# EAGLE design transceiver-AX5043 (EAGLE 9.5.1)
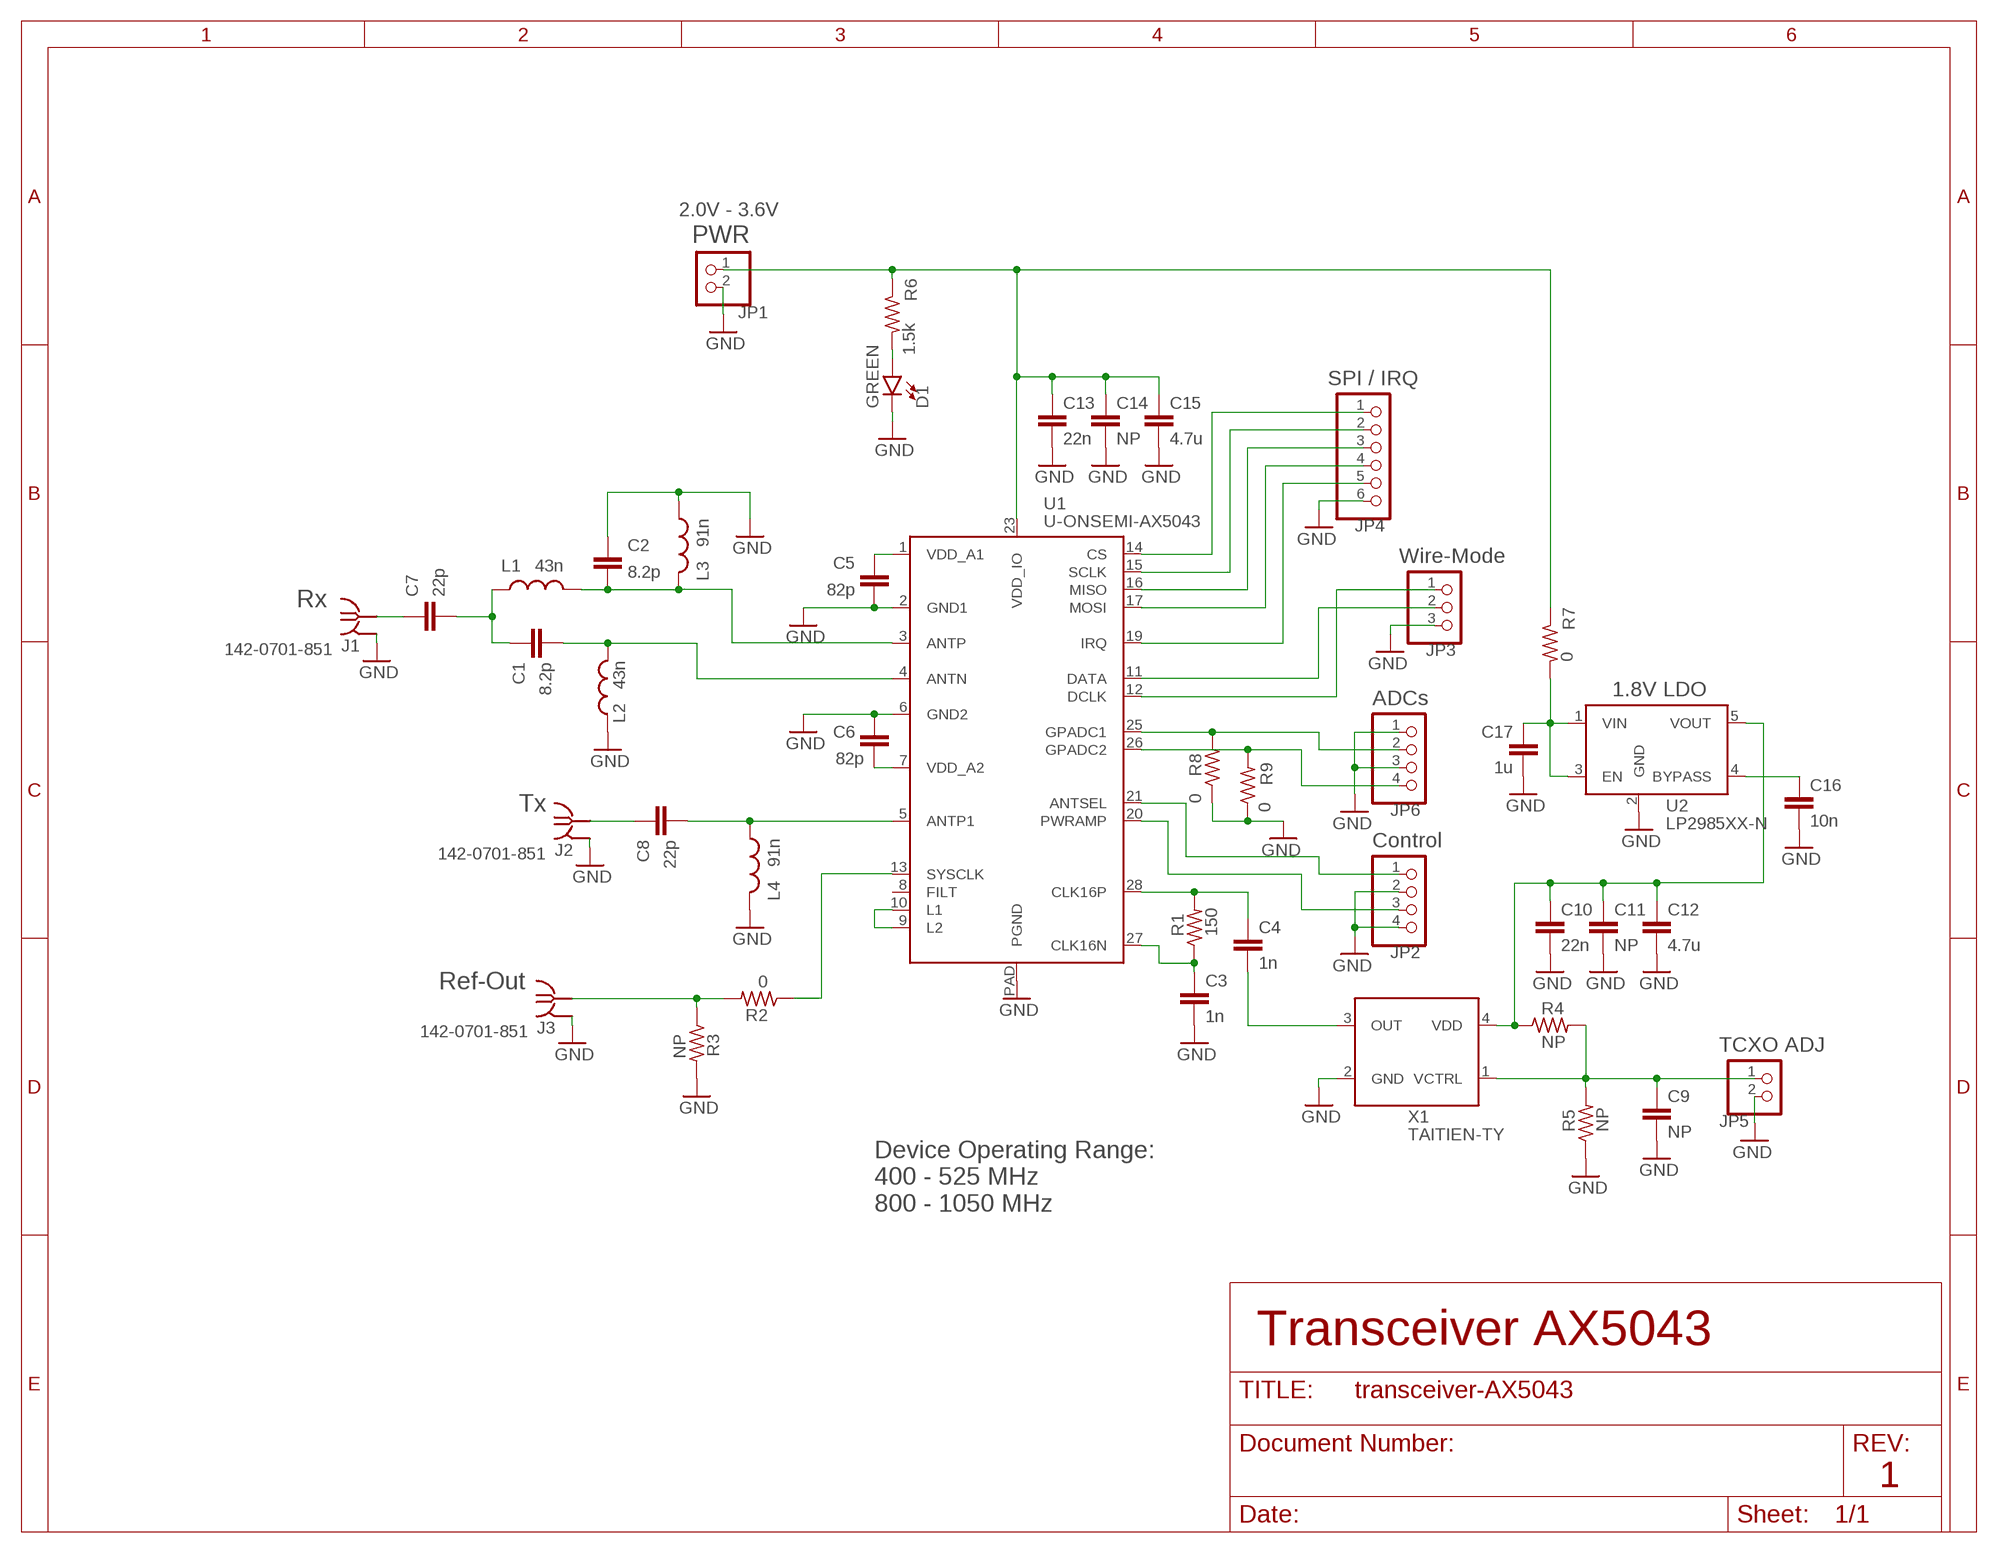
[diagram p0: schematic, sheet 1]

## Parts
C1  8.2p  C-EU0402-C-NOSILK  [.0402-C-NOSILK]
C2  8.2p  C-EU0402-C-NOSILK  [.0402-C-NOSILK]
C3  1n  C-EU0402-C-NOSILK  [.0402-C-NOSILK]
C4  1n  C-EU0402-C-NOSILK  [.0402-C-NOSILK]
C5  82p  C-EU0402-C-NOSILK  [.0402-C-NOSILK]
C6  82p  C-EU0402-C-NOSILK  [.0402-C-NOSILK]
C7  22p  C-EU0402-C-NOSILK  [.0402-C-NOSILK]
C8  22p  C-EU0402-C-NOSILK  [.0402-C-NOSILK]
C9  NP  C-EU0603-C-NOSILK  [.0603-C-NOSILK]
C10  22n  C-EU0603-C-NOSILK  [.0603-C-NOSILK]
C11  NP  C-EU0603-C-NOSILK  [.0603-C-NOSILK]
C12  4.7u  C-EU0603-C-NOSILK  [.0603-C-NOSILK]
C13  22n  C-EU0603-C-NOSILK  [.0603-C-NOSILK]
C14  NP  C-EU0603-C-NOSILK  [.0603-C-NOSILK]
C15  4.7u  C-EU0603-C-NOSILK  [.0603-C-NOSILK]
C16  10n  C-EU0603-C-NOSILK  [.0603-C-NOSILK]
C17  1u  C-EU0603-C-NOSILK  [.0603-C-NOSILK]
D1  GREEN  LED-GREEN0603  [LED-0603]
J1  142-0701-851  [142-0701-851]
J2  142-0701-851  [142-0701-851]
J3  142-0701-851  [142-0701-851]
JP1  PINHD-1X2  [1X02]
JP2  PINHD-1X4  [1X04]
JP3  PINHD-1X3  [1X03]
JP4  PINHD-1X6  [1X06]
JP5  PINHD-1X2  [1X02]
JP6  PINHD-1X4  [1X04]
L1  43n  L-US0402-C-NOSILK  [.0402-C-NOSILK]
L2  43n  L-US0402-C-NOSILK  [.0402-C-NOSILK]
L3  91n  L-US0603-C-NOSILK  [.0603-C-NOSILK]
L4  91n  L-US0603-C-NOSILK  [.0603-C-NOSILK]
R1  150  R-US_0402-C-NOSILK  [.0402-C-NOSILK]
R2  0  R-US_0402-C-NOSILK  [.0402-C-NOSILK]
R3  NP  R-US_0402-C-NOSILK  [.0402-C-NOSILK]
R4  NP  R-US_0603-B-NOSILK  [.0603-B-NOSILK]
R5  NP  R-US_0603-B-NOSILK  [.0603-B-NOSILK]
R6  1.5k  R-US_0603-B-NOSILK  [.0603-B-NOSILK]
R7  0  R-US_0603-C-NOSILK  [.0603-C-NOSILK]
R8  0  R-US_0402-C-NOSILK  [.0402-C-NOSILK]
R9  0  R-US_0402-C-NOSILK  [.0402-C-NOSILK]
U1  U-ONSEMI-AX5043  [QFN28-5X5-WITH-CENTER-PAD]
U2  LP2985XX-N  [SOT-23]
X1  TAITIEN-TY  [2.5X2.0]

## Nets
1V8: C10.1 C11.1 C12.1 R4.1 U2.5(VOUT) X1.4(VDD)
2V7: C13.1 C14.1 C15.1 JP1.1 R6.1 R7.1 U1.23(VDD_IO)
ADC1: JP6.2 R8.2 U1.25(GPADC1)
ADC2: JP6.4 R9.2 U1.26(GPADC2)
ANTN: C1.2 L2.2 U1.4(ANTN)
ANTP: C2.2 L1.2 L3.1 U1.3(ANTP)
ANTP1: C8.2 L4.2 U1.5(ANTP1)
ANTSEL: JP2.1 U1.21(ANTSEL)
CLKN: C3.1 R1.1 U1.27(CLK16N)
CLKP: C4.1 R1.2 U1.28(CLK16P)
CS: JP4.1 U1.14(CS)
DATA: JP3.2 U1.11(DATA)
DCLK: JP3.1 U1.12(DCLK)
GND: C2.1 C3.2 C5.2 C6.1 C9.2 C10.2 C11.2 C12.2 C13.2 C14.2 C15.2 C16.2 C17.2 D1.C J1.GND1(GND) J1.GND2(GND) J1.GND3(GND) J1.GND4(GND) J2.GND1(GND) J2.GND2(GND) J2.GND3(GND) J2.GND4(GND) J3.GND1(GND) J3.GND2(GND) J3.GND3(GND) J3.GND4(GND) JP1.2 JP2.2 JP2.4 JP3.3 JP4.6 JP5.2 JP6.1 JP6.3 L2.1 L3.2 L4.1 R3.2 R5.1 R8.1 R9.1 U1.2(GND1) U1.6(GND2) U1.PAD(PGND) U2.2(GND) X1.2(GND)
IRQ: JP4.5 U1.19(IRQ)
MISO: JP4.3 U1.16(MISO)
MOSI: JP4.4 U1.17(MOSI)
N$1: C5.1 U1.1(VDD_A1)
N$2: C17.1 R7.2 U2.1(VIN) U2.3(EN)
N$3: U1.9(L2) U1.10(L1)
N$6 [RF2]: C4.2 X1.3(OUT)
N$20 [RF2]: C1.1 C7.2 L1.1
N$23: C9.1 JP5.1 R4.2 R5.2 X1.1(VCTRL)
N$26: D1.A R6.2
N$27: C16.1 U2.4(BYPASS)
N$30: C6.2 U1.7(VDD_A2)
PWRAMP: JP2.3 U1.20(PWRAMP)
REF-OUT [RF1]: J3.RF1(RF) R2.2 R3.1
RX [RF1]: C7.1 J1.RF1(RF)
SCLK: JP4.2 U1.15(SCLK)
SYSCLK: R2.1 U1.13(SYSCLK)
TX [RF1]: C8.1 J2.RF1(RF)
Unconnected: U1.8(FILT)

## Notes on the sheet
- 2.0V - 3.6V
- PWR
- SPI / IRQ
- Wire-Mode
- Rx
- 1.8V LDO
- ADCs
- Tx
- Control
- Ref-Out
- TCXO ADJ
- Device Operating Range:
  400 - 525 MHz
  800 - 1050 MHz
- Transceiver AX5043
- 1

## Library data of the parts
C1-C17 = oresat-rcl:C-EU: CAPACITOR, European symbol
D1 = SparkFun-LED:LED-GREEN: Green SMD LED Used in manufacturing of various products at SparkFun Packages: 0603 - SMD 0603 package [Product Link] <http://www.futureelectronics.com/en/technologies/semiconductors/optoelectronics/leds/Pages/9894312-LTST-C190GKT.aspx?CrossPart=HSMG-C190&IM=0> LilyPad 1206 - SMD1206 LilyPad package [Product Link] <http://www.futureelectronics.com/en/Technologies/Product.aspx?ProductID=IN150NGHARVATEKCORPORATION2049943&IM=0> 1206 - SMD1206 package [Product Link] <http://www.futureelectronics.com/en/technologies/semiconductors/optoelectronics/leds/Pages/8315665-LTST-C150KGKT.aspx?IM=0> 1206 Bottom Mount -SMD 1206 Bottom Mount [Product Link] <http://www.digikey.com/product-detail/en/lite-on-inc/LTST-C230KGKT/160-1456-1-ND/386854> SparkFun Products: Pro Mini 328 -5V <https://www.sparkfun.com/products/821> RedBoard <https://www.sparkfun.com/products/12757> MP3 Trigger <https://www.sparkfun.com/products/13720> Makey Makey <https://www.sparkfun.com/products/11076>
J1-J3 = J-Cinch-142-0701-851-SMA-end-launch:142-0701-851: SMA Jack 50Ω - End Launch Source: Datasheet <https://belfuse.com/resources/productinformations/cinchconnectivitysolutions/johnson/pi-ccs-john-142-0701-851.pdf>
JP1 JP5 = pinhead:PINHD-1X2: PIN HEADER
JP2 JP6 = pinhead:PINHD-1X4: PIN HEADER
JP3 = pinhead:PINHD-1X3: PIN HEADER
JP4 = pinhead:PINHD-1X6: PIN HEADER
L1-L4 = oresat-rcl:L-US: INDUCTOR, American symbol
R1-R9 = oresat-rcl:R-US_: RESISTOR, American symbol
U1 = U-ON-Semi-AX5043-radio:U-ONSEMI-AX5043
U2 = U-TI-LP2985XX-N-linear-reg:LP2985XX-N: TI 150mA Low Noise LDO Regulators LP2985-N (various fixed >2.0V) Source: Datasheet <http://www.ti.com/product/LP2985-N?qgpn=lp2985-n> LP2985LV-N (1.5, 1.8, 2.0V fixed) Source: Datasheet <http://www.ti.com/product/LP2985LV-N?qgpn=lp2985lv-n>
X1 = X-Taitien-TY-TCXO:TAITIEN-TY: Clipped Sine Wave TCXO Stability: 1.0ppm (-40 to +85 ℃) Source: Datasheet <https://www.taitien.com/wp-content/uploads/2015/12/XO-0081_TY.pdf>

## Net classes
1 RF1: clearance 0.8 mm
2 RF2: clearance 0.4 mm

## Board
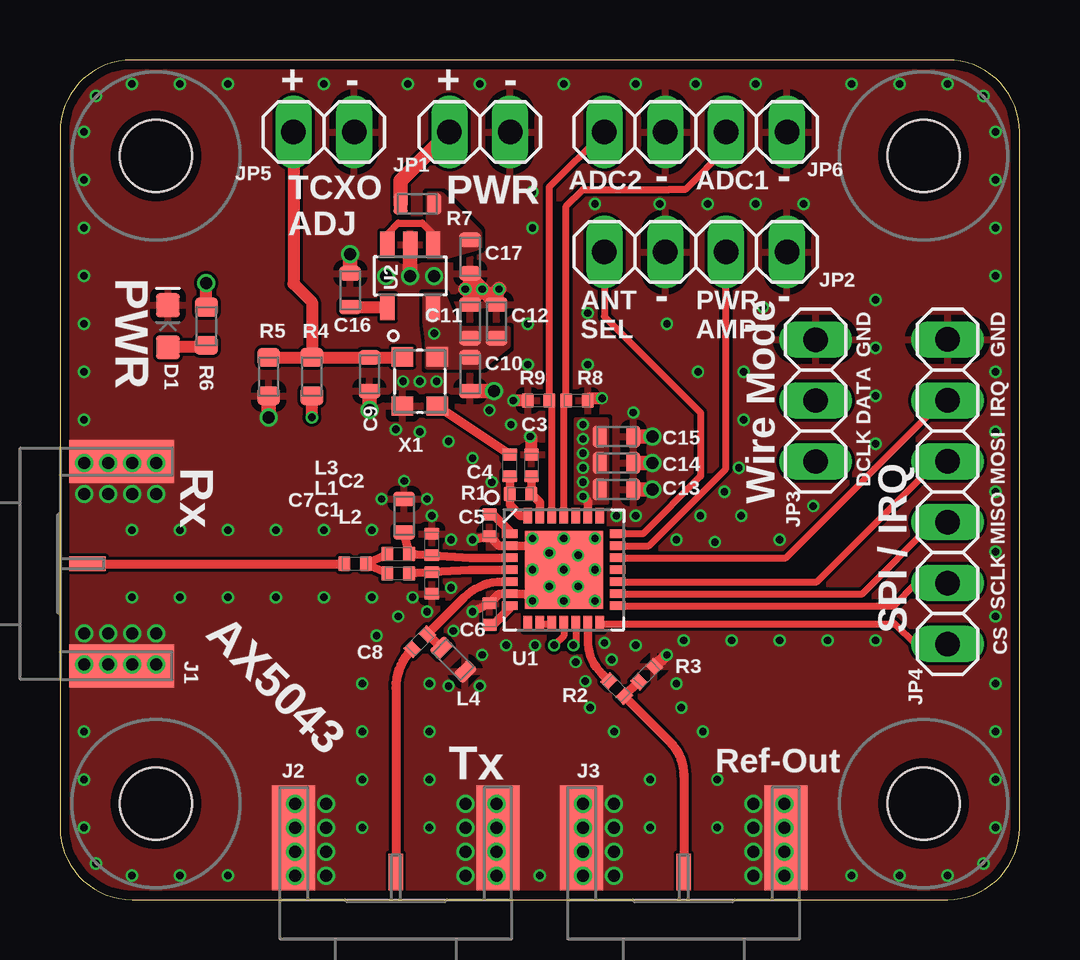
[diagram p1: board, top side]
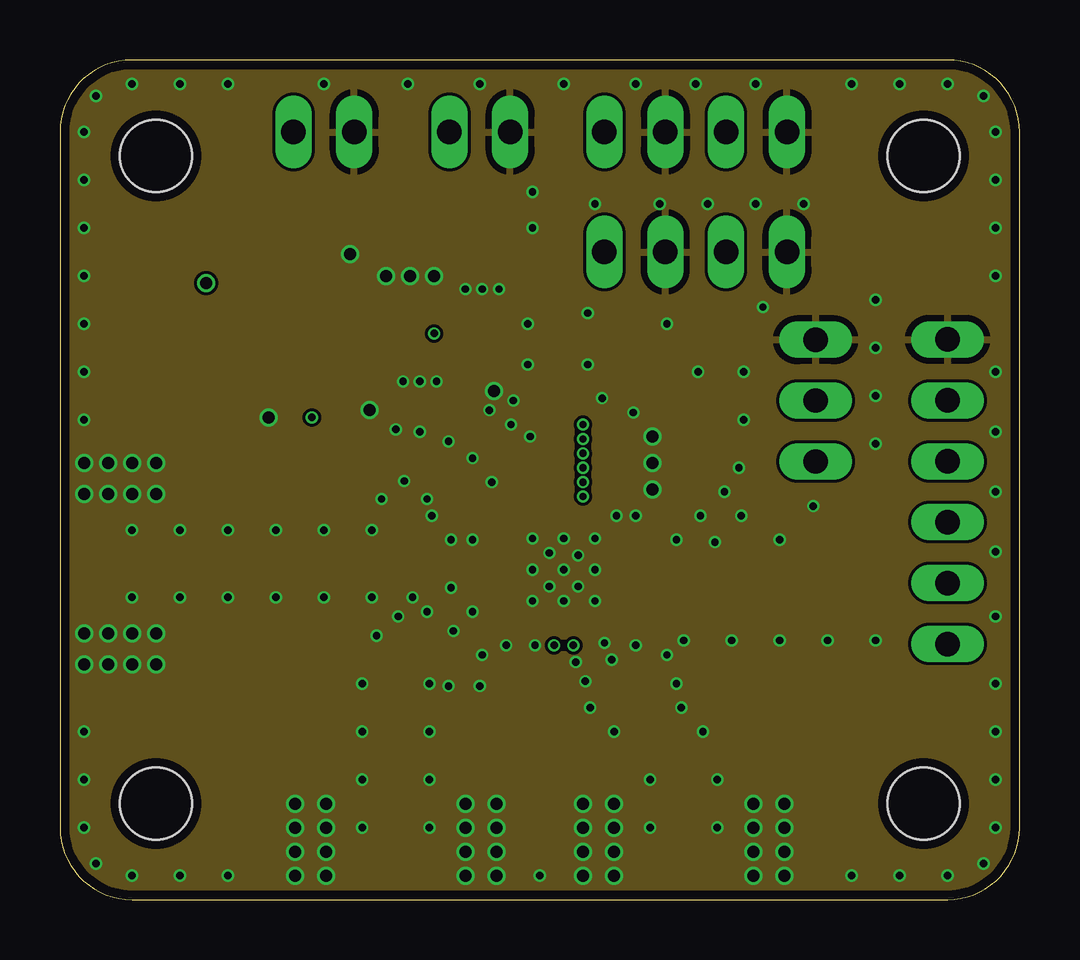
[diagram p2: board, inner layer Route2]
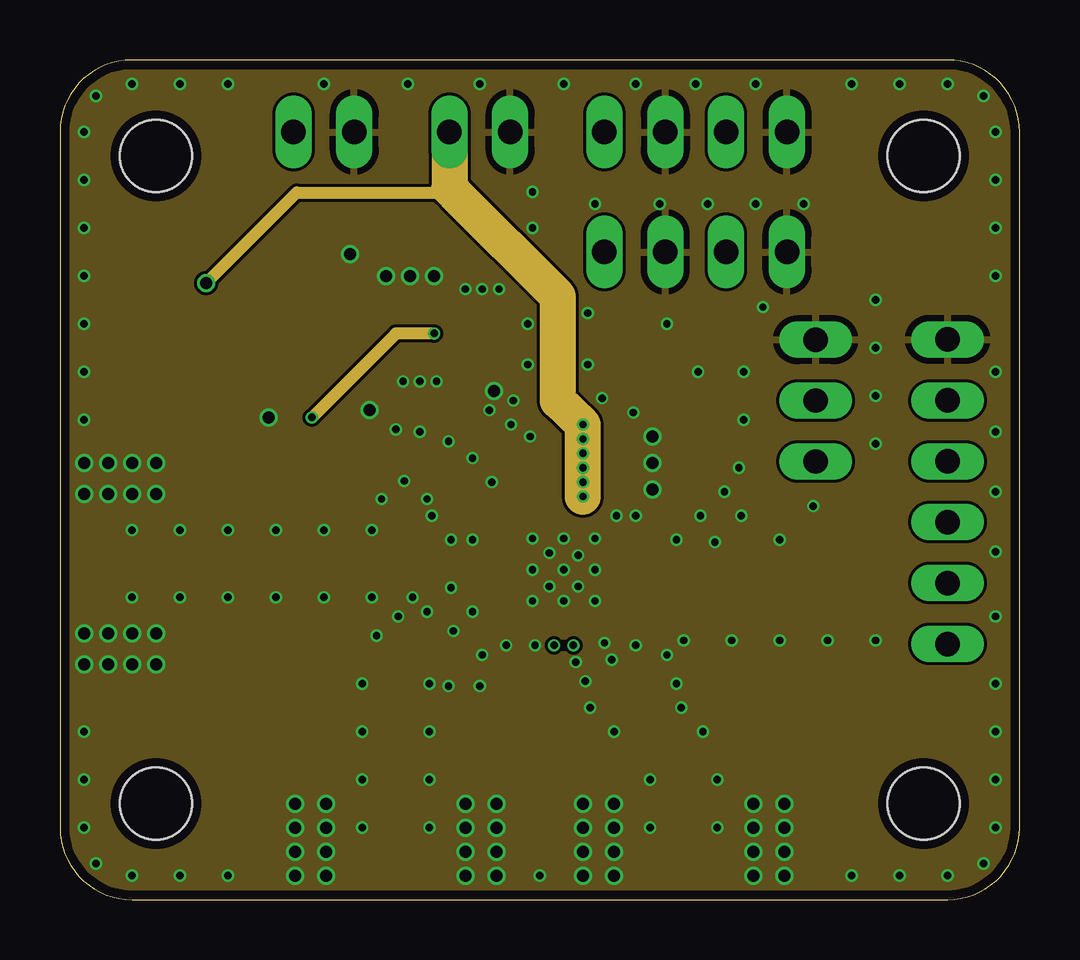
[diagram p3: board, inner layer Route15]
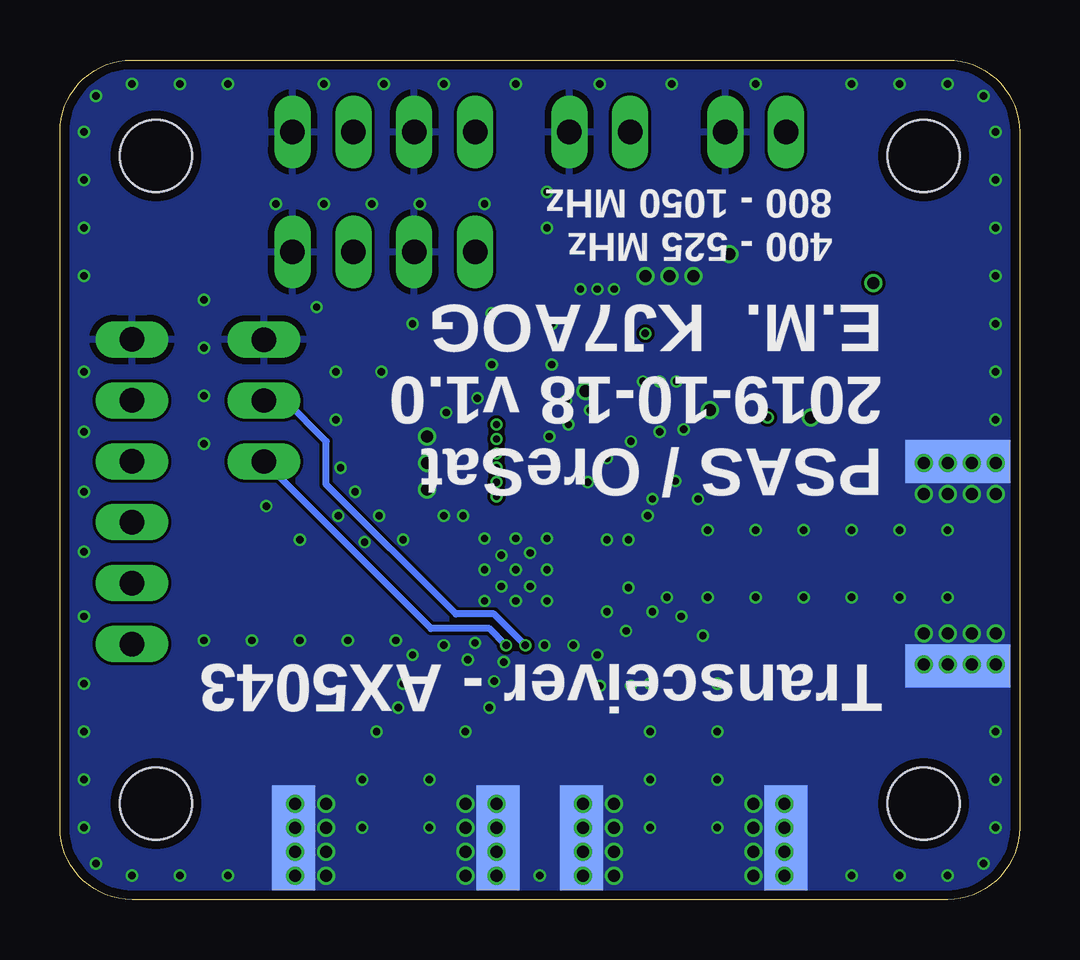
[diagram p4: board, bottom side, seen from below]

Size 40 x 35 mm. Coordinates in mm from the lower left corner, seen from the top.
Outline: 37,35 3,35 arc90 0,32 0,3 arc90 3,0 37,0 arc90 40,3 40,32 arc90 37,35
Copper layers (1*2*15*16): Top 0.035559375mm / dielectric 0.17018125mm / Route2 0.01778125mm / dielectric 47mil / Route15 0.01778125mm / dielectric 0.17018125mm / Bottom 0.035559375mm
Design rules "oshpark-4layer-tented": minimum track width 5mil, minimum drill 10mil, track to track 5mil, track to pad 5mil, pad to pad 5mil, via to via 5mil, smd to smd 5mil, copper to edge 15mil, drill to drill 6mil, minimum pad ring 4mil, minimum via ring 4mil, stop-mask expansion 2.5mil, vias tented up to drill 20mil, thermal gap 10mil
Holes 3 mm at 4,4 36,4 36,31 4,31

### Footprints (pad centres in the part's own frame; a part is rotated, then mirrored left to right if it is on the bottom)
.0402-C-NOSILK = smd 0.5 x 0.6: 1 -0.45,0; 2 0.45,0
.0603-C-NOSILK = smd 0.6 x 0.9: 1 -0.7,0; 2 0.7,0
LED-0603 = smd 1 x 1: A -0.877,0; C 0.877,0
142-0701-851 = smd 1.8 x 4.37: GND1 -4.255,-2.566; GND2 4.255,-2.566 | smd 1.8 x 4.37 bottom: GND3 -4.255,-2.566; GND4 4.255,-2.566 | smd 0.6 x 1.53: RF1 0,-1.146
1X02 = drill 1.016 long: 1 -1.27,0; 2 1.27,0
1X04 = drill 1.016 long: 1 -3.81,0; 2 -1.27,0; 3 1.27,0; 4 3.81,0
1X03 = drill 1.016 long: 1 -2.54,0; 2 0,0; 3 2.54,0
1X06 = drill 1.016 long: 1 -6.35,0; 2 -3.81,0; 3 -1.27,0; 4 1.27,0; 5 3.81,0; 6 6.35,0
.0603-B-NOSILK = smd 0.8 x 0.95: 1 -0.8,0; 2 0.8,0
QFN28-5X5-WITH-CENTER-PAD = smd 0.65 x 0.35: 1 -2.25,1.5; 2 -2.25,1; 3 -2.25,0.5; 4 -2.25,0; 5 -2.25,-0.5; 6 -2.25,-1; 7 -2.25,-1.5; 15 2.25,-1.5; 16 2.25,-1; 17 2.25,-0.5; 18 2.25,0; 19 2.25,0.5; 20 2.25,1; 21 2.25,1.5 | smd 0.35 x 0.65: 8 -1.5,-2.25; 9 -1,-2.25; 10 -0.5,-2.25; 11 0,-2.25; 12 0.5,-2.25; 13 1,-2.25; 14 1.5,-2.25; 22 1.5,2.25; 23 1,2.25; 24 0.5,2.25; 25 0,2.25; 26 -0.5,2.25; 27 -1,2.25; 28 -1.5,2.25 | smd 3.25 x 3.25: PAD 0,0
SOT-23 = smd 1.1 x 0.6: 1 -1.3,0.95; 2 -1.3,0; 3 -1.3,-0.95; 4 1.3,-0.95; 5 1.3,0.95
2.5X2.0 = smd 0.8 x 0.9: 1 -1.025,-0.725; 2 1.025,-0.725; 3 1.025,0.725; 4 -1.025,0.725

### Placement (x,y rotation side)
C1  14.1,13.6 0 top
C2  15.5,14.8 270 top
C3  19.65,18.1 90 top
C4  18.75,18.1 90 top
C5  17.9,15.6 270 top
C6  17.9,11.9 270 top
C7  12.3,14 0 top
C8  15,10.75 45 top
C9  12.9,21.9 270 top
C10  17.1,21.9 270 top
C11  17.1,24.1 90 top
C12  18.2,24.1 90 top
C13  23.2,17.1 0 top
C14  23.2,18.2 0 top
C15  23.2,19.3 0 top
C16  12.1,25.4 90 top
C17  17.1,26.8 270 top
D1  4.5,23.9 90 top
J1  0,14 90 top
J2  14,0 180 top
J3  26,0 180 top
JP1  17.5,32 0 top
JP2  26.5,27 0 top
JP3  31.5,20.8 90 top
JP4  37,17 90 top
JP5  11,32 0 top
JP6  26.5,32 180 top
L1  14.1,14.4 0 top
L2  15.5,13.2 90 top
L3  14.35,16 90 top
L4  16.4,10 135 top
R1  19.2,16.9 180 top
R2  23.2,8.8 315 top
R3  24.45,9.4 45 top
R4  10.5,21.8 90 top
R5  8.7,21.8 90 top
R6  6.1,23.9 270 top
R7  14.9,29 0 top
R8  21.55,20.8 180 top
R9  19.95,20.8 0 top
U1  21,13.75 0 top
U2  14.6,26 270 top
X1  15,21.6 270 top

### Tracks (layer width: path | path; a pad name or v marks a point on that pad's centre or on a via)
1V8  (via drill 0.3)
  Top 0.5: v10.5,20.1 R4.1
  Route15 0.5: v15.6,23.6 14,23.6 v10.5,20.1
  pour Top (no thermals): 15.3,23.3 15.3,22.2 17.6,22.2 18.7,23.1 18.7,23.8 16.6,23.8 16,25.2 15.2,25.2 15.2,24.1
2V7  (via drill 0.3, 0.5)
  Top 0.35: U1.23 22,16.6 v21.8,16.8
  Top 0.5: R6.1 v6.1,25.7
  Top 0.6: R7.1 14.2,29.97 JP1.1
  Route15 0.5: v6.1,25.7 9.87,29.47 16.43,29.47
  Route15 1.5: JP1.1 16.23,29.67 16.43,29.47 20.75,25.15 20.75,20.8 v21.8,19.8 v21.8,16.8
  other vias: 21.8,17.4 21.8,18 21.8,18.6 21.8,19.2
  pour Top (no thermals): 21.5,16.55 22.8,16.55 22.8,20 21.5,20
ADC1
  Top 0.3: U1.25 21,20.7 R8.2 21.1,28.9 21.8,29.6 25.4,29.6 26.07,29.6 27.77,31.3 JP6.2
ADC2
  Top 0.3: U1.26 20.5,20.7 R9.2 20.4,29.71 JP6.4
ANTN
  Top 0.35: U1.4 17.1,13.75 L2.2 C1.2
ANTP
  Top 0.35: U1.3 17.1,14.25 C2.2 L1.2 L3.1
ANTP1
  Top 0.35: U1.5 18.43,13.25 arc45 16.84,12.59 C8.2 15.33,11.07 L4.2
ANTSEL
  Top 0.3: U1.21 24.3,15.25 26.7,17.65 26.7,20.3 22.69,24.31 JP2.1
CLKN
  Top 0.35: C3.1 R1.1 20,16.55 U1.27
CLKP
  Top 0.35: U1.28 19.2,16 18.75,16.45 R1.2 C4.1
CS
  Top 0.3: U1.14 34.8,11.5 35.65,10.65 JP4.1
DATA  (via drill 0.3)
  Top 0.3: U1.11 21,11 v20.6,10.6
  Bottom 0.3: v20.6,10.6 21.9,11.9 23.5,11.9 28.9,17.3 28.9,19.1 30.6,20.8 JP3.2
DCLK  (via drill 0.3)
  Top 0.3: U1.12 21.5,10.7 v21.4,10.6
  Bottom 0.3: v21.4,10.6 22.1,11.3 24.54,11.3 JP3.1
GND  (via drill 0.3, 0.5)
  Top 0.35: v19.7,12.45 19.4,12.75 U1.6 18.3,12.75 C6.1 v17.2,12 | v19.7,15.05 19.4,14.75 U1.2 18.3,14.75 C5.2 v17.2,15
  Top 0.5: R9.1 v18.9,20.8 | R8.1 22.1,20.9 v22.6,20.9 | R3.2 v25.3,10.2 | C3.2 19.65,19.25 v19.6,19.3
  Top 0.6: U2.2 v14.6,26 | C13.2 v24.7,17.1 | C14.2 v24.7,18.2 | C15.2 v24.7,19.3 | v18.3,25.45 18.2,25.35 C12.2 18.2,24.85 v17.6,25.45 | v17.6,25.45 17.1,25.95 C17.2 17.1,25.65 v16.9,25.45 17.1,25.25 C11.2 17.1,24.95 v17.6,25.45 | C10.2 v18.1,21.2 | R5.1 v8.7,20.1 | C9.2 v12.9,20.4 | C16.2 v12.1,26.9
  other vias: 15.6,26 13.6,26 15,21.6 15.7,21.6 14.3,21.6 21,13.75 22.3,15.05 22.3,12.45 19.7,13.75 21,12.45 22.3,13.75 21,15.05 20.4,13.05 21.6,13.05 21.6,14.35 20.4,14.45 3,12.6 5,12.6 7,12.6 9,12.6 11,12.6 13,12.6 3,15.4 5,15.4 7,15.4 9,15.4 11,15.4 13,15.4 14.7,12.6 16.3,13 16.3,15 16.4,11.2 15.3,12 15.5,16 15.3,16.7 14.35,17.45 13.4,16.7 17.6,10.2 16.2,8.9 17.5,8.9 12.6,3 12.6,5 12.6,7 12.6,9 15.4,9 15.4,7 15.4,5 15.4,3 13.2,11 14.1,11.8 24.6,3 24.6,5 27.4,3 27.4,5 23.1,7 26.8,7 22.1,8 25.9,8 25.7,9 22.7,10.7 23,10 21.9,9.1 21.5,9.9 24,10.6 3,1 1,3 5,1 7,1 20,1 37,1 35,1 33,1 39,3 39,5 39,7 39,9 39,11.8 39,17 39,14.5 38.5,1.5 1.5,1.5 39,19.5 39,22 39,32 38.5,33.5 39,30 39,28 39,26 37,34 35,34 33,34 21,34 14.5,34 3,34 5,34 7,34 1,32 1.5,33.5 1,30 1,28 1,26 1,24 1,22 1,20 1,5 1,7 29,34 26.5,34 24,34 11,34 17.5,34 1,18.2 2,18.2 3,18.2 4,18.2 1,16.9 2,16.9 3,16.9 4,16.9 1,9.8 2,9.8 3,9.8 4,9.8 1,11.1 2,11.1 3,11.1 4,11.1 9.8,1 9.8,2 9.8,3 9.8,4 11.1,4 11.1,3 11.1,2 11.1,1 18.2,1 18.2,2 18.2,3 18.2,4 16.9,4 16.9,3 16.9,2 16.9,1 21.8,1 21.8,2 21.8,3 21.8,4 23.1,4 23.1,3 23.1,2 23.1,1 30.2,1 30.2,2 30.2,3 30.2,4 28.9,4 28.9,3 28.9,2 28.9,1 27.3,14.9 28.4,16 26,10.8 28,10.8 30,10.8 32,10.8 34,10.8 30,15 31.4,16.4 25.7,15 26.7,16 27.7,17 28.3,18 23.2,16 24,16 19.8,10.6 18.6,10.6 15,19.5 14,19.6 16.2,19.1 17.2,18.4 18,17.4 17.9,20.4 18.8,19.8 28.5,20 28.5,22 29.3,24.7 25.3,24 26.6,22 19.5,22.3 19.5,24 22,22.3 22,24.45 19.7,28 34,19 34,21 34,23 34,25 22.3,29 25,29 27,29 29,29 31,29 23.9,20.3 19.7,29.5
  pour Top (rank 2): 0,35 0,0 40,0 40,35
  pour Bottom: 0,35 0,0 40,0 40,35
  pour Route2: 0,35 0,0 40,0 40,35
  pour Route15: 0,35 0,0 40,0 40,35
  pour Top (no thermals): 0,20 5,20 5,8 0,8
  pour Top (rank 2, no thermals): 8,0 32,0 32,5 8,5
  pour Bottom (no thermals): 8,5 8,0 32,0 32,5
  pour Bottom (no thermals): 0,20 0,8 5,8 5,20
  cutout Top (no thermals): 19.2,14.4 19.2,13.2 22.8,13.2 22.8,14.4
  cutout Top (no thermals): 20.4,11.95 21.6,11.95 21.6,15.55 20.4,15.55
IRQ
  Top 0.3: U1.19 30.25,14.25 36.81,20.81 JP4.5
MISO
  Top 0.3: U1.16 33.45,12.75 36.43,15.73 JP4.3
MOSI
  Top 0.3: U1.17 31.55,13.25 36.57,18.27 JP4.4
N$1
  Top 0.35: C5.1 18.05,16.05 18.75,15.35 U1.1
N$2
  Top 0.3: U2.3 13.65,27.75 14.1,28.2 15.1,28.2 15.55,27.75 U2.1
  pour Top (no thermals): 15.35,29.4 15.35,26.8 16.1,26.8 17.5,27.2 17.5,27.8 15.9,29.4
N$3
  Top 0.3: U1.9 U1.10
N$6
  Top 0.39: X1.3 C4.2
N$20
  Top 0.35: L1.1 C7.2 C1.1
N$23
  Top 0.5: R5.2 R4.2 | R4.2 C9.1 14.25,22.6 X1.1 | JP5.1 9.73,25.67 10.5,24.9 R4.2
N$26
  Top 0.5: R6.2 6.02,23.02 D1.A
N$27
  Top 0.5: C16.1 U2.4
N$30
  Top 0.35: C6.2 18.05,11.45 18.75,12.15 U1.7
PWRAMP
  Top 0.3: U1.20 24.55,14.75 27.75,17.95 27.75,26.98 JP2.3
REF-OUT
  Top 0.35: 24.11,9.07 arc-45 R3.1
  Top 0.38: 24.11,9.07 R2.2 25.41,6.59 arc-45 26,5.17 J3.RF1
  pour Top: 25.8,1.7 25.8,1.9 26,2.1 26.2,1.9 26.2,1.7
RX
  Top 0.38: J1.RF1 C7.1
  pour Top: 1.7,14.2 1.9,14.2 2.1,14 1.9,13.8 1.7,13.8
SCLK
  Top 0.3: U1.15 34.75,12.25 35.7,13.2 JP4.2
SYSCLK
  Top 0.35: U1.13 22,10.83 arc45 22.59,9.41 R2.1
TX
  Top 0.38: 14.66,10.41 arc45 14,8.82 J2.RF1
  Top 0.39: C8.1 14.66,10.41
  pour Top: 13.8,1.7 13.8,1.9 14,2.1 14.2,1.9 14.2,1.7

### Text on the board
tPlace: + | - | + | - | ADC2 | - | ADC1 | - | PWR | TCXO / ADJ | PWR | - | - | ANT / SEL | PWR / AMP | GND | GND | DATA | IRQ | Rx | DCLK | MOSI | Wire Mode | MISO | SCLK | AX5043 | SPI / IRQ | CS | Tx | Ref-Out
bPlace: 400 - 525 MHz / 800 - 1050 MHz | Transceiver - AX5043 / / / PSAS / OreSat / 2019-10-18 v1.0 / E.M. KJ7AOG